# EAGLE design 555 (EAGLE 9.6.0)
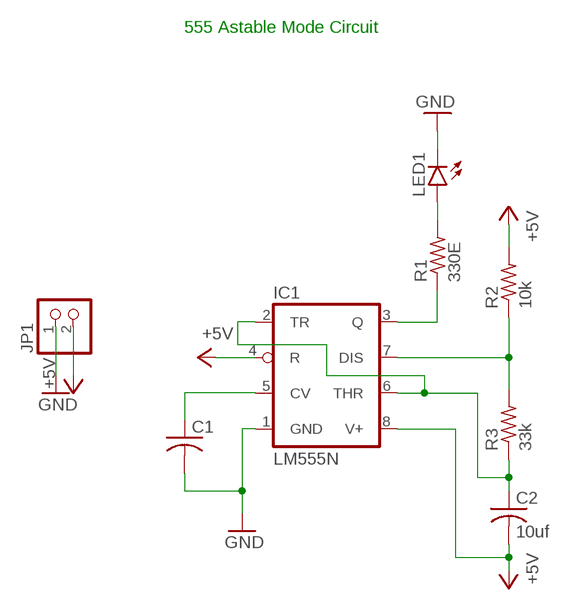
[diagram p0: schematic, sheet 1]

## Parts
C1  C-US025-024X044  [C025-024X044]
C2  10uf  C-US025-024X044  [C025-024X044]
IC1  LM555N  [DIL08-ROUND]
JP1  PINHD-1X2  [1X02]
LED1  LED5MM  [LED5MM]
R1  330E  R-US_0204/7  [0204/7]
R2  10k  R-US_0204/7  [0204/7]
R3  33k  R-US_0204/7  [0204/7]

## Nets
+5V: C2.2 IC1.4(R) IC1.8(V+) JP1.2 R2.2
GND: C1.2 IC1.1(GND) JP1.1 LED1.K(C)
N$1: LED1.A R1.2
N$2: IC1.3(Q) R1.1
N$3: IC1.7(DIS) R2.1 R3.2
N$4: C2.1 IC1.2(TR) IC1.6(THR) R3.1
N$5: C1.1 IC1.5(CV)

## Notes on the sheet
- 555 Astable Mode Circuit

## Library data of the parts
C1 C2 = rcl:C-US: CAPACITOR, American symbol; SPICEPREFIX: C
IC1 = adafruit:*555: TIMER Changed DIP package to have round (not oval) pin pads http://www.ladyada.net/library/pcb/eaglelibrary.html
JP1 = pinhead:PINHD-1X2: PIN HEADER
LED1 = led:LED: LED OSRAM: - CHIPLED LG R971, LG N971, LY N971, LG Q971, LY Q971, LO R971, LY R971 LH N974, LH R974 LS Q976, LO Q976, LY Q976 LO Q996 - Hyper CHIPLED LW Q18S LB Q993, LB Q99A, LB R99A - SideLED LS A670, LO A670, LY A670, LG A670, LP A670 LB A673, LV A673, LT A673, LW A673 LH A674 LY A675 LS A676, LA A676, LO A676, LY A676, LW A676 LS A679, LY A679, LG A679 - Hyper Micro SIDELED® LS Y876, LA Y876, LO Y876, LY Y876 LT Y87S - SmartLED LW L88C, LW L88S LB L89C, LB L89S, LG L890 LS L89K, LO L89K, LY L89K LS L896, LA L896, LO L896, LY L896 - TOPLED LS T670, LO T670, LY T670, LG T670, LP T670 LSG T670, LSP T670, LSY T670, LOP T670, LYG T670 LG T671, LOG T671, LSG T671 LB T673, LV T673, LT T673, LW T673 LH T674 LS T676, LA T676, LO T676, LY T676, LB T676, LH T676, LSB T676, LW T676 LB T67C, LV T67C, LT T67C, LS T67K, LO T67K, LY T67K, LW E67C LS E67B, LA E67B, LO E67B, LY E67B, LB E67C, LV E67C, LT E67C LW T67C LS T679, LY T679, LG T679 LS T770, LO T770, LY T770, LG T770, LP T770 LB T773, LV T773, LT T773, LW T773 LH T774 LS E675, LA E675, LY E675, LS T675 LS T776, LA T776, LO T776, LY T776, LB T776 LHGB T686 LT T68C, LB T68C - Hyper Mini TOPLED® LB M676 - Mini TOPLED Santana® LG M470 LS M47K, LO M47K, LY M47K Source: http://www.osram.convergy.de LUXEON: - LUMILED® LXK2-PW12-R00, LXK2-PW12-S00, LXK2-PW14-U00, LXK2-PW14-V00 LXK2-PM12-R00, LXK2-PM12-S00, LXK2-PM14-U00 LXK2-PE12-Q00, LXK2-PE12-R00, LXK2-PE12-S00, LXK2-PE14-T00, LXK2-PE14-U00 LXK2-PB12-K00, LXK2-PB12-L00, LXK2-PB12-M00, LXK2-PB14-N00, LXK2-PB14-P00, LXK2-PB14-Q00 LXK2-PR12-L00, LXK2-PR12-M00, LXK2-PR14-Q00, LXK2-PR14-R00 LXK2-PD12-Q00, LXK2-PD12-R00, LXK2-PD12-S00 LXK2-PH12-R00, LXK2-PH12-S00 LXK2-PL12-P00, LXK2-PL12-Q00, LXK2-PL12-R00 Source: www.luxeon.com KINGBRIGHT: KA-3528ASYC Source: www.kingbright.com
R1-R3 = rcl:R-US_: RESISTOR, American symbol; SPICEPREFIX: R

## Board
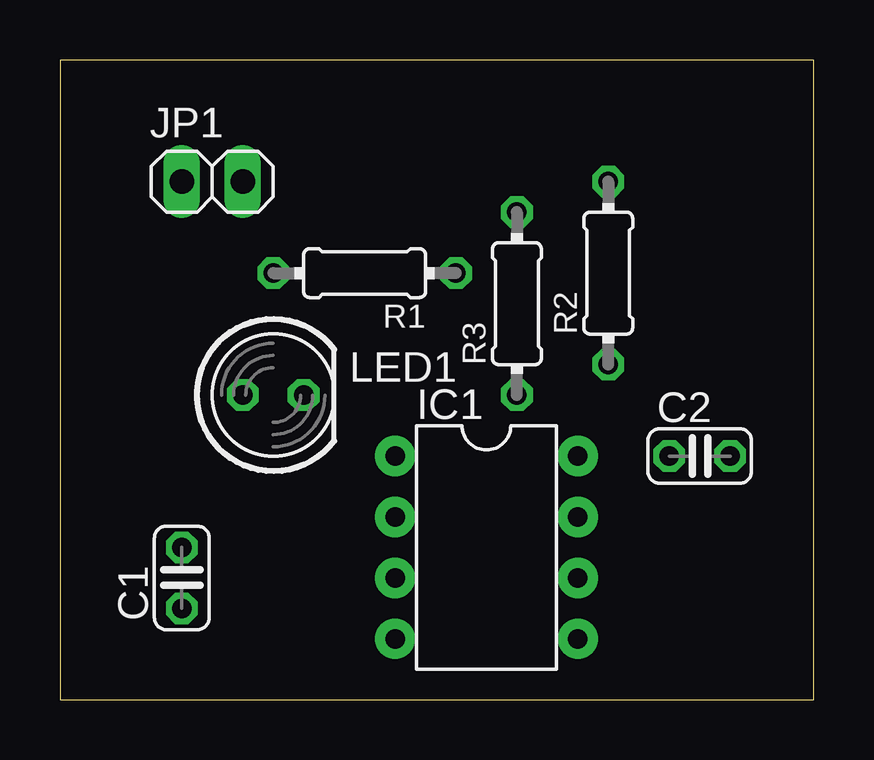
[diagram p1: board, top side]
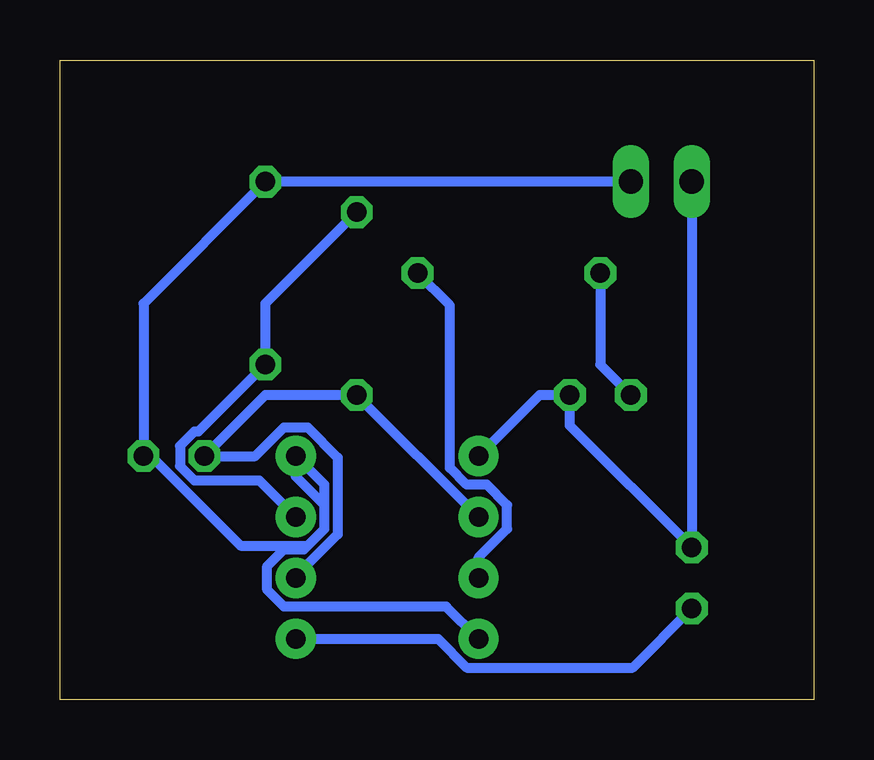
[diagram p2: board, bottom side, seen from below]

Size 31.42 x 26.66 mm. Coordinates in mm from the lower left corner, seen from the top.
Outline: 0,0 31.42,0 31.42,26.66 0,26.66 0,0
Copper layers (1*16): Top 0.035mm / dielectric 1.5mm / Bottom 0.035mm
Design rules "default": minimum track width 6mil, minimum drill 0.35mm, track to track 6mil, track to pad 6mil, pad to pad 6mil, via to via 6mil, smd to smd 6mil, copper to edge 40mil, drill to drill 6mil, minimum pad ring 10mil, minimum via ring 8mil, stop-mask expansion 4mil, vias tented up to drill 0mil, thermal gap 10mil

### Footprints (pad centres in the part's own frame; a part is rotated, then mirrored left to right if it is on the bottom)
C025-024X044 = drill 0.813 octagon: 1 -1.27,0; 2 1.27,0
DIL08-ROUND = drill 0.813 pad 1.676: 1 -3.81,-3.81; 2 -1.27,-3.81; 3 1.27,-3.81; 4 3.81,-3.81; 5 3.81,3.81; 6 1.27,3.81; 7 -1.27,3.81; 8 -3.81,3.81
1X02 = drill 1.016 long: 1 -1.27,0; 2 1.27,0
LED5MM = drill 0.813 octagon: A -1.27,0; K 1.27,0
0204/7 = drill 0.813 octagon: 1 -3.81,0; 2 3.81,0

### Placement (x,y rotation side)
C1  5.08,5.08 90 top
C2  26.67,10.16 0 top
IC1  17.78,6.35 270 top
JP1  6.35,21.59 0 top
LED1  8.89,12.7 0 top
R1  12.7,17.78 180 top
R2  22.86,17.78 90 top
R3  19.05,16.51 90 top

### Tracks (layer width: path | path; a pad name or v marks a point on that pad's centre or on a via)
+5V
  Bottom 0.406: JP1.2 R2.2 27.94,16.51 C2.2 27.63,10.16 23.89,6.43 21.1,6.43 | 21.1,6.43 20.4,7.13 20.4,8.11 | 20.4,8.11 21.59,9.31 IC1.8 20.4,8.97 20.4,8.11 | 21.1,6.43 21.25,6.27 22.08,6.27 22.78,5.57 22.78,4.59 22.08,3.89 15.32,3.89 IC1.4
GND
  Bottom 0.406: JP1.1 C1.2 10.16,11.43 LED1.K 11.43,12.7 IC1.1
N$1
  Bottom 0.406: R1.2 8.89,13.97 LED1.A
N$2
  Bottom 0.406: IC1.3 13.97,5.93 12.78,7.13 12.78,8.11 13.63,8.97 14.46,8.97 15.16,9.67 15.16,16.43 R1.1
N$3
  Bottom 0.406: R3.2 22.86,16.51 R2.1 25.65,11.18 25.82,11.18 26.42,10.58 26.42,9.74 25.82,9.14 23.11,9.14 IC1.7
N$4
  Bottom 0.406: IC1.6 21.59,5.14 19.84,6.89 19.84,10.1 21.1,11.35 22.08,11.35 23.28,10.16 C2.1 22.86,12.7 R3.1 IC1.2
N$5
  Bottom 0.406: IC1.5 15.66,2.54 14.46,1.35 7.54,1.35 C1.1